# Altium schematic sheet Kajtuś-DSP_eeprom.SchDoc
size A4; DocumentNumber: 8; SheetNumber: 8; SheetTotal: 9
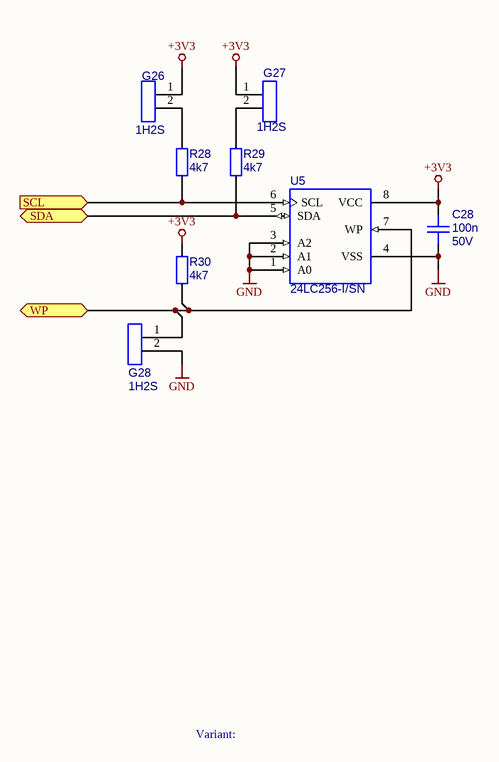
[diagram p0: Kajtuś-DSP_eeprom.SchDoc]

## Parts
C28  value 100n  Voltage: 50V  [C_0603_MA]  (hidden comment: C_0603_100n_50V_X7R)
G26  value 1H2S  [1H2S_FHS]  (hidden comment: G_1H2S)
G27  value 1H2S  [1H2S_FHS]  (hidden comment: G_1H2S)
G28  value 1H2S  [1H2S_FHS]  (hidden comment: G_1H2S)
R28  value 4k7  [R_0603_MA]  (hidden comment: R_0603_4k7_5%)
R29  value 4k7  [R_0603_MA]  (hidden comment: R_0603_4k7_5%)
R30  value 4k7  [R_0603_MA]  (hidden comment: R_0603_4k7_5%)
U5  24LC256-I/SN  [SO-8]

## Ports
SCL (in), SDA (bidir), WP (bidir)

## Nets
+3V3: C28.1 G26.1 G27.1 R30.1 U5.8(VCC)
GND: C28.2 G28.2 U5.1(A0) U5.2(A1) U5.3(A2) U5.4(VSS)
SCL: R28.2 U5.6(SCL) ; port SCL
SDA: R29.2 U5.5(SDA) ; port SDA
WP: G28.1 R30.2 U5.7(WP) ; port WP
NetG26_2: G26.2 R28.1
NetG27_2: G27.2 R29.1

## Notes on the sheet
- Variant:
- Title
- Size:
- Date:
- A4
- Number:
- Time:
- Revision:
- Sheet
- of
- File:

## Library data of the parts
C28 = C_0603_100n_50V_X7R: Kondensator ceramiczny SMD; Vendor: TME; Part Number: C_0603_100n_50V_X7R
G26-G28 = G_1H2S: Listwa jednorzędowa, 1x2 piny, raster 2,54mm; Manufacturer: generic; Vendor: TME; Part Number: G_1H2S
R28-R30 = R_0603_4k7_5%: Rezystor SMD; Manufacturer: Royal Ohm; Vendor: TME; Tolerance: 5%; Part Number: R_0603_4k7_5%
U5 = U_24LC256-I/SN: 256Kbit, 400kHz, 2.5V, I2C Serial EEPROM, 8-Pin SOIC 150mil, Industrial Temperature; Manufacturer: Microchip; Part Number: 24LC256-I/SN; ComponentLink1Description: Manufacturer URL; ComponentLink1URL: http://www.microchip.com/; ComponentLink2Description: Datasheet; ComponentLink2URL: http://ww1.microchip.com/downloads/en/DeviceDoc/21203P.pdf; Package: SO-8